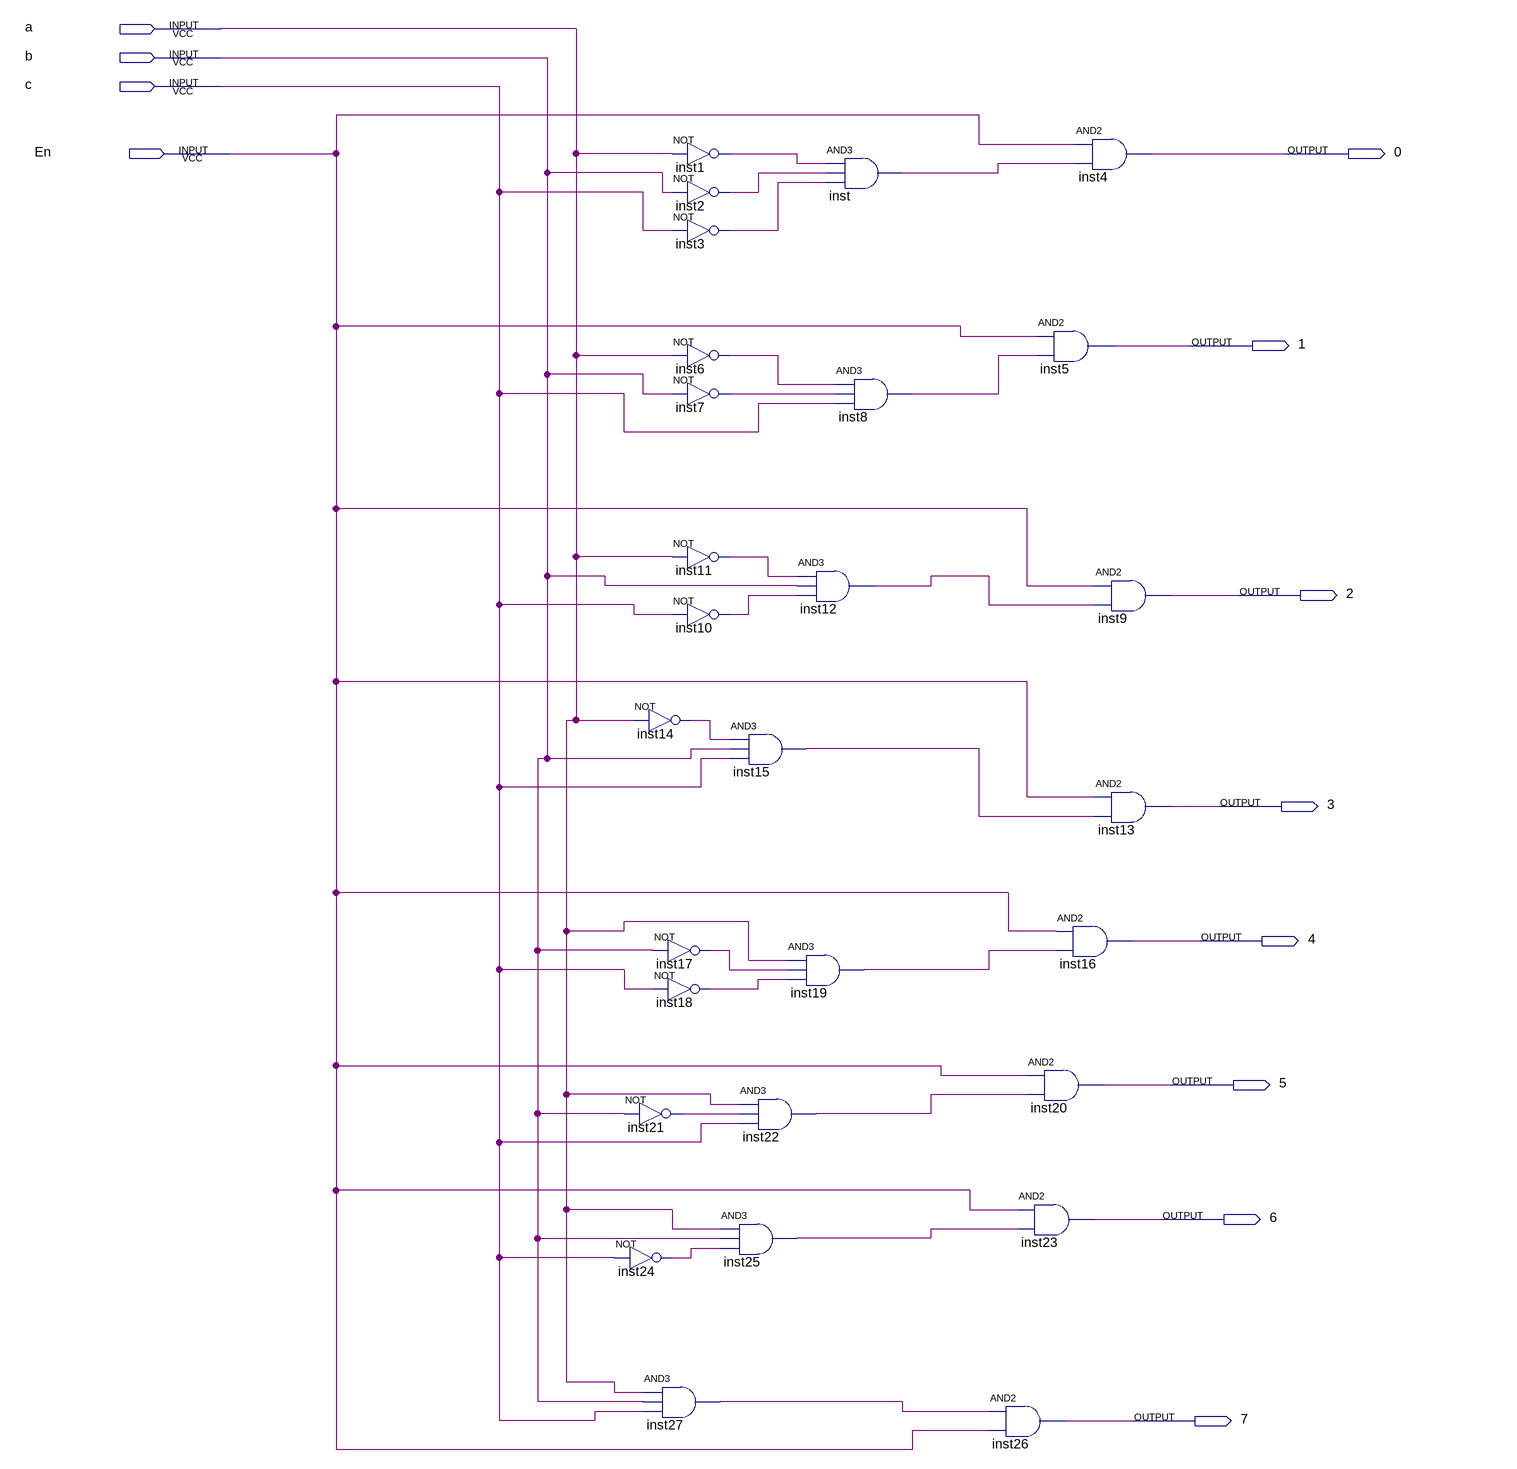
[diagram p0: schematic sheet]
// Quartus schematic Reg_Sel.bdf as structural Verilog: 28 symbols, 12 pins
module Reg_Sel (
  input  a,
  input  b,
  input  c,
  input  En,
  output \0 ,
  output \1 ,
  output \2 ,
  output \3 ,
  output \4 ,
  output \5 ,
  output \6 ,
  output \7 
);

  wire inst1_out, inst2_out, inst3_out, inst6_out, inst7_out, inst8_out, inst10_out, inst11_out, inst12_out,
       inst14_out, inst15_out, inst17_out, inst18_out, inst19_out, inst21_out, inst22_out, inst24_out,
       inst25_out, inst27_out, inst_out;

  not inst21 (inst21_out, b);
  not inst24 (inst24_out, c);
  not inst1 (inst1_out, a);
  not inst2 (inst2_out, b);
  not inst3 (inst3_out, c);
  not inst6 (inst6_out, a);
  not inst7 (inst7_out, b);
  not inst11 (inst11_out, a);
  not inst10 (inst10_out, c);
  not inst14 (inst14_out, a);
  not inst17 (inst17_out, b);
  not inst18 (inst18_out, c);
  and inst27 (inst27_out, a, b, c);
  and inst15 (inst15_out, inst14_out, b, c);
  and inst22 (inst22_out, a, inst21_out, c);
  and inst25 (inst25_out, a, b, inst24_out);
  and inst (inst_out, inst1_out, inst2_out, inst3_out);
  and inst8 (inst8_out, inst6_out, inst7_out, c);
  and inst12 (inst12_out, inst11_out, b, inst10_out);
  and inst19 (inst19_out, a, inst17_out, inst18_out);
  and inst26 (\7 , inst27_out, En);
  and inst4 (\0 , En, inst_out);
  and inst5 (\1 , En, inst8_out);
  and inst16 (\4 , En, inst19_out);
  and inst20 (\5 , En, inst22_out);
  and inst23 (\6 , En, inst25_out);
  and inst9 (\2 , En, inst12_out);
  and inst13 (\3 , En, inst15_out);
endmodule
